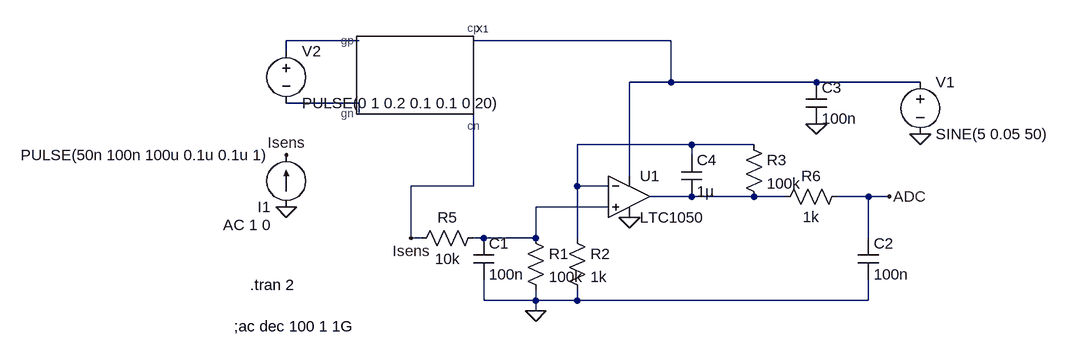
[diagram p0: schematic Draft2.asc]
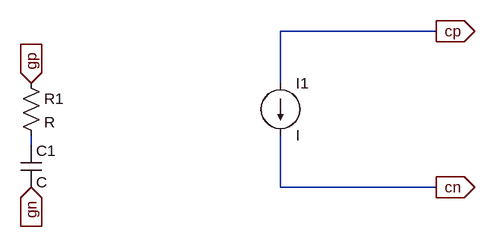
[diagram p1: sub-circuit capteurgaz.asc]
Draft2.asc, the LTspice schematic file:
Version 4
SHEET 1 1040 680
WIRE -128 -496 -240 -496
WIRE 352 -496 48 -496
WIRE -240 -480 -240 -496
WIRE 352 -432 352 -496
WIRE 352 -432 288 -432
WIRE 576 -432 352 -432
WIRE 736 -432 576 -432
WIRE -128 -400 -240 -400
WIRE -128 -384 -128 -400
WIRE 384 -336 208 -336
WIRE 480 -336 384 -336
WIRE 384 -320 384 -336
WIRE 288 -288 288 -432
WIRE 48 -272 48 -384
WIRE 48 -272 -48 -272
WIRE 208 -272 208 -336
WIRE 256 -272 208 -272
WIRE 384 -256 320 -256
WIRE 480 -256 384 -256
WIRE 528 -256 480 -256
WIRE 656 -256 608 -256
WIRE 688 -256 656 -256
WIRE 256 -240 144 -240
WIRE -48 -192 -48 -272
WIRE -32 -192 -48 -192
WIRE 64 -192 48 -192
WIRE 144 -192 144 -240
WIRE 144 -192 64 -192
WIRE 208 -192 208 -272
WIRE 656 -192 656 -256
WIRE 64 -96 64 -128
WIRE 144 -96 144 -112
WIRE 144 -96 64 -96
WIRE 208 -96 208 -112
WIRE 208 -96 144 -96
WIRE 656 -96 656 -128
WIRE 656 -96 208 -96
WIRE 144 -80 144 -96
FLAG 144 -80 0
FLAG 576 -368 0
FLAG 736 -352 0
FLAG -48 -192 Isens
FLAG 688 -256 ADC
FLAG 288 -224 0
FLAG -240 -320 Isens
FLAG -240 -240 0
SYMBOL res 128 -208 R0
SYMATTR InstName R1
SYMATTR Value 100k
SYMBOL res 192 -208 R0
SYMATTR InstName R2
SYMATTR Value 1k
SYMBOL cap 48 -192 R0
SYMATTR InstName C1
SYMATTR Value 100n
SYMBOL res 64 -208 R90
WINDOW 0 0 56 VBottom 2
WINDOW 3 32 56 VTop 2
SYMATTR InstName R5
SYMATTR Value 10k
SYMBOL cap 368 -320 R0
SYMATTR InstName C4
SYMATTR Value 1µ
SYMBOL res 464 -352 R0
SYMATTR InstName R3
SYMATTR Value 100k
SYMBOL res 624 -272 R90
WINDOW 0 0 56 VBottom 2
WINDOW 3 32 56 VTop 2
SYMATTR InstName R6
SYMATTR Value 1k
SYMBOL cap 640 -192 R0
SYMATTR InstName C2
SYMATTR Value 100n
SYMBOL cap 560 -432 R0
SYMATTR InstName C3
SYMATTR Value 100n
SYMBOL voltage 736 -448 R0
WINDOW 123 24 44 Left 2
WINDOW 39 0 0 Left 2
SYMATTR InstName V1
SYMATTR Value SINE(5 0.05 50)
SYMBOL current -240 -240 R180
WINDOW 123 24 -28 Left 2
WINDOW 39 0 0 Left 2
SYMATTR InstName I1
SYMATTR Value PULSE(50n 100n 100u 0.1u 0.1u 1)
SYMATTR Value2 AC 1 0
SYMBOL Opamps\\LTC1050 288 -320 R0
SYMATTR InstName U1
SYMBOL capteurGaz -64 -448 R0
SYMATTR InstName X1
SYMBOL voltage -240 -496 R0
WINDOW 123 0 0 Left 2
WINDOW 39 0 0 Left 2
SYMATTR InstName V2
SYMATTR Value PULSE(0 1 0.2 0.1 0.1 0 20)
TEXT -320 -56 Left 2 !;ac dec 100 1 1G
TEXT -296 -120 Left 2 !.tran 2

capteurgaz.asc, the sub-circuit schematic file:
Version 4
SHEET 1 880 680
WIRE 736 0 496 0
WIRE 496 80 496 0
WIRE 112 176 112 160
WIRE 496 240 496 160
WIRE 736 240 496 240
FLAG 112 80 gp
IOPIN 112 80 In
FLAG 112 240 gn
IOPIN 112 240 In
FLAG 736 0 cp
IOPIN 736 0 Out
FLAG 736 240 cn
IOPIN 736 240 Out
SYMBOL cap 96 176 R0
SYMATTR InstName C1
SYMBOL res 96 64 R0
SYMATTR InstName R1
SYMBOL current 496 80 R0
SYMATTR InstName I1

The netlist it stands for:
* Draft2.asc
R1 N006 0 100k
R2 N004 0 1k
C1 N006 0 100n
R5 N006 Isens 10k
C4 N004 N005 1µ
R3 N004 N005 100k
R6 ADC N005 1k
C2 ADC 0 100n
C3 N002 0 100n
V1 N002 0 SINE(5 0.05 50)
I1 0 Isens PULSE(50n 100n 100u 0.1u 0.1u 1) AC 1 0
XU1 N006 N004 N002 0 N005 LTC1050  ; pins In+ In- V+ V- OUT
XX1 N001 N002 Isens N003 capteurgaz
V2 N001 N003 PULSE(0 1 0.2 0.1 0.1 0 20)

* block symbol definitions
.subckt capteurgaz gp cp cn gn
C1 N001 gn C
R1 gp N001 R
I1 cp cn I
.ends capteurgaz

;ac dec 100 1 1G
.tran 2
.lib LTC.lib
.backanno
.end